# Altium schematic sheet MAIN.SchDoc
size 381 x 254 mm; SheetNumber: 1; SheetTotal: 8
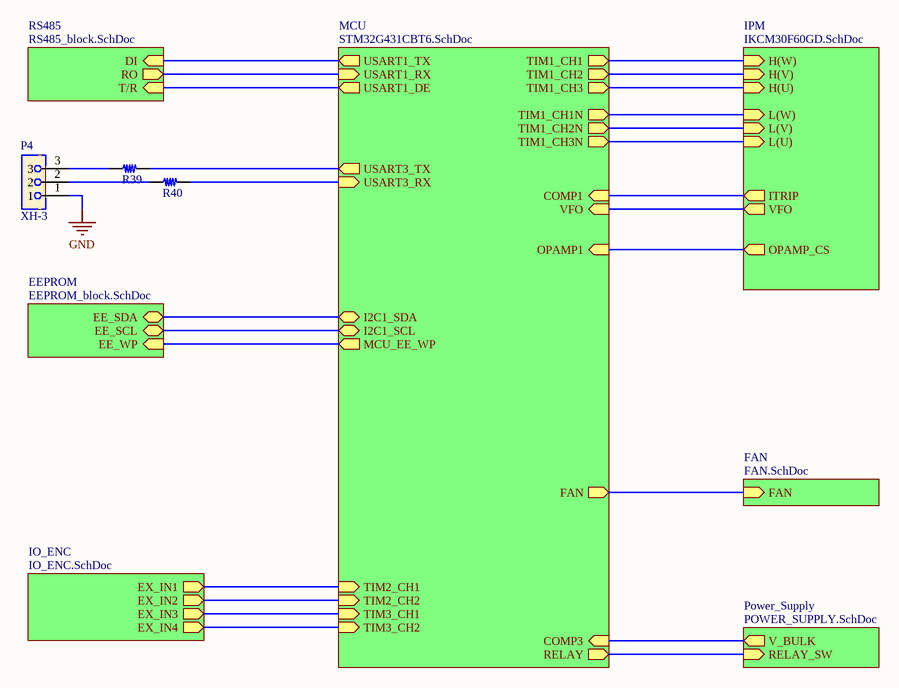
[diagram p0: MAIN.SchDoc]

## Parts
P4  XH-3  [XH-3]
R39  RES_SMD  [R 0603]  (value not drawn)
R40  RES_SMD  [R 0603]  (value not drawn)

## Sub-sheets
EEPROM = EEPROM_block.SchDoc: EE_SDA (bidir), EE_SCL (bidir), EE_WP (in)
FAN = FAN.SchDoc: FAN (in)
IO_ENC = IO_ENC.SchDoc: EX_IN1 (out), EX_IN2 (out), EX_IN3 (out), EX_IN4 (out)
IPM = IKCM30F60GD.SchDoc: H(U) (in), H(V) (in), H(W) (in), L(U) (in), L(V) (in), L(W) (in), VFO (out), OPAMP_CS (out), ITRIP (out)
MCU = STM32G431CBT6.SchDoc: TIM1_CH1 (out), TIM1_CH2 (out), TIM1_CH3 (out), TIM1_CH1N (out), TIM1_CH2N (out), TIM1_CH3N (out), USART1_TX (out), USART1_RX (in), VFO (in), COMP3 (in), OPAMP1 (in), RELAY (out), I2C1_SDA (bidir), I2C1_SCL (bidir), USART1_DE (out), TIM3_CH1 (in), TIM3_CH2 (in), TIM2_CH2 (in), TIM2_CH1 (in), FAN (out), MCU_EE_WP (out), COMP1 (in), USART3_TX (out), USART3_RX (in)
Power_Supply = POWER_SUPPLY.SchDoc: V_BULK (out), RELAY_SW (in)
RS485 = RS485_block.SchDoc: RO (out), DI (in), T/R (in)

## Nets
GND: P4.1
NetP4_2: P4.2 R40.1
NetP4_3: P4.3 R39.1
NetR39_2: R39.2 ; sheet MCU/USART3_TX
NetR40_2: R40.2 ; sheet MCU/USART3_RX
(unnamed): sheet IPM/H(U), sheet MCU/TIM1_CH3
(unnamed): sheet IPM/H(V), sheet MCU/TIM1_CH2
(unnamed): sheet IPM/H(W), sheet MCU/TIM1_CH1
(unnamed): sheet IPM/L(U), sheet MCU/TIM1_CH3N
(unnamed): sheet IPM/L(V), sheet MCU/TIM1_CH2N
(unnamed): sheet IPM/L(W), sheet MCU/TIM1_CH1N
(unnamed): sheet IPM/VFO, sheet MCU/VFO
(unnamed): sheet IPM/OPAMP_CS, sheet MCU/OPAMP1
(unnamed): sheet IPM/ITRIP, sheet MCU/COMP1
(unnamed): sheet MCU/USART1_TX, sheet RS485/DI
(unnamed): sheet MCU/USART1_RX, sheet RS485/RO
(unnamed): sheet MCU/COMP3, sheet Power_Supply/V_BULK
(unnamed): sheet MCU/RELAY, sheet Power_Supply/RELAY_SW
(unnamed): sheet MCU/I2C1_SDA, sheet EEPROM/EE_SDA
(unnamed): sheet MCU/I2C1_SCL, sheet EEPROM/EE_SCL
(unnamed): sheet MCU/USART1_DE, sheet RS485/T/R
(unnamed): sheet MCU/TIM3_CH1, sheet IO_ENC/EX_IN3
(unnamed): sheet MCU/TIM3_CH2, sheet IO_ENC/EX_IN4
(unnamed): sheet MCU/TIM2_CH2, sheet IO_ENC/EX_IN2
(unnamed): sheet MCU/TIM2_CH1, sheet IO_ENC/EX_IN1
(unnamed): sheet MCU/FAN, sheet FAN/FAN
(unnamed): sheet MCU/MCU_EE_WP, sheet EEPROM/EE_WP